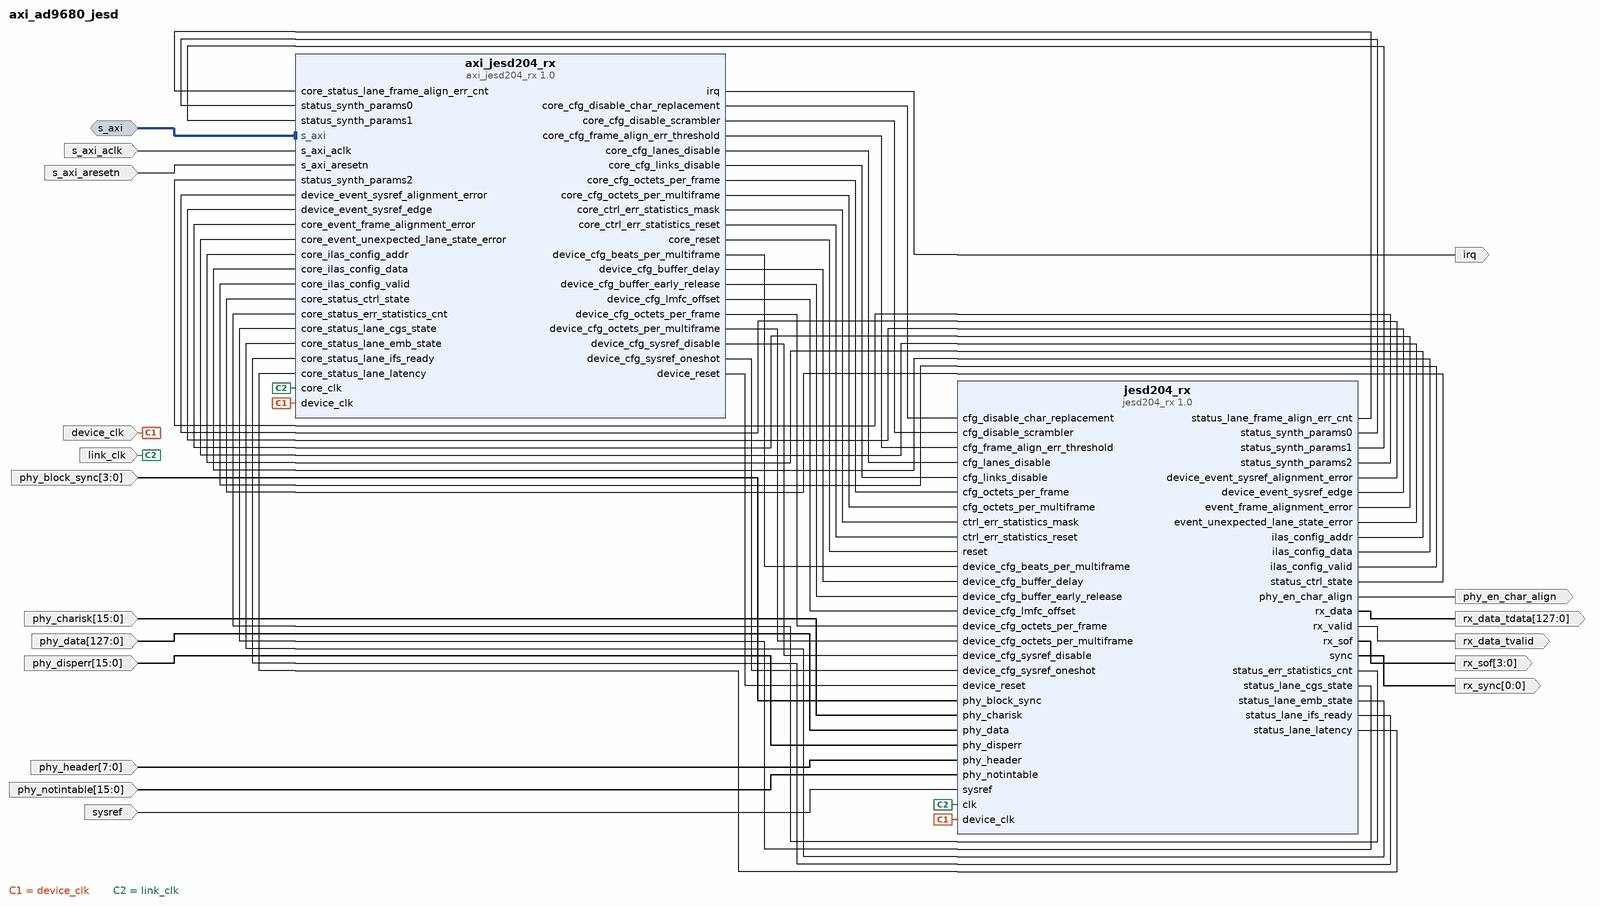
[diagram p0: block diagram of the top level]
# Vivado block design axi_ad9680_jesd, xczu7ev-fbvb900-1-e, Vivado 2022.2
create_bd_design axi_ad9680_jesd

create_bd_intf_port -mode Slave -vlnv xilinx.com:interface:aximm_rtl:1.0 s_axi
set_property -dict [list \
  CONFIG.ADDR_WIDTH 14 \
  CONFIG.ARUSER_WIDTH 0 \
  CONFIG.AWUSER_WIDTH 0 \
  CONFIG.BUSER_WIDTH 0 \
  CONFIG.DATA_WIDTH 32 \
  CONFIG.HAS_BRESP 1 \
  CONFIG.HAS_BURST 0 \
  CONFIG.HAS_CACHE 0 \
  CONFIG.HAS_LOCK 0 \
  CONFIG.HAS_PROT 1 \
  CONFIG.HAS_QOS 0 \
  CONFIG.HAS_REGION 0 \
  CONFIG.HAS_RRESP 1 \
  CONFIG.HAS_WSTRB 1 \
  CONFIG.ID_WIDTH 0 \
  CONFIG.MAX_BURST_LENGTH 1 \
  CONFIG.NUM_READ_OUTSTANDING 1 \
  CONFIG.NUM_READ_THREADS 1 \
  CONFIG.NUM_WRITE_OUTSTANDING 1 \
  CONFIG.NUM_WRITE_THREADS 1 \
  CONFIG.PROTOCOL AXI4LITE \
  CONFIG.READ_WRITE_MODE READ_WRITE \
  CONFIG.RUSER_BITS_PER_BYTE 0 \
  CONFIG.RUSER_WIDTH 0 \
  CONFIG.SUPPORTS_NARROW_BURST 0 \
  CONFIG.WUSER_BITS_PER_BYTE 0 \
  CONFIG.WUSER_WIDTH 0 \
] [get_bd_intf_ports s_axi]
create_bd_port -dir I -type clk device_clk
set_property -dict {CONFIG.FREQ_HZ 100000000} [get_bd_ports device_clk]
create_bd_port -dir I -type clk link_clk
set_property -dict {CONFIG.FREQ_HZ 100000000} [get_bd_ports link_clk]
create_bd_port -dir I -type clk s_axi_aclk
set_property -dict {CONFIG.FREQ_HZ 100000000} [get_bd_ports s_axi_aclk]
create_bd_port -dir I -type rst s_axi_aresetn
create_bd_port -dir O -type intr irq
create_bd_port -dir O -from 0 -to 0 rx_sync
create_bd_port -dir O phy_en_char_align
create_bd_port -dir I sysref
create_bd_port -dir O -from 127 -to 0 rx_data_tdata
create_bd_port -dir O rx_data_tvalid
create_bd_port -dir O -from 3 -to 0 rx_sof
create_bd_port -dir I -from 127 -to 0 phy_data
create_bd_port -dir I -from 7 -to 0 phy_header
create_bd_port -dir I -from 15 -to 0 phy_charisk
create_bd_port -dir I -from 15 -to 0 phy_notintable
create_bd_port -dir I -from 15 -to 0 phy_disperr
create_bd_port -dir I -from 3 -to 0 phy_block_sync

create_bd_cell -type ip -vlnv analog.devices:user:axi_jesd204_rx:1.0 axi_jesd204_rx
set_property -dict {CONFIG.NUM_LANES 4} [get_bd_cells axi_jesd204_rx]
create_bd_cell -type ip -vlnv analog.devices:user:jesd204_rx:1.0 jesd204_rx
set_property -dict {CONFIG.ASYNC_CLK 0 CONFIG.NUM_LANES 4} [get_bd_cells jesd204_rx]

# ---- connections ----

connect_bd_intf_net [get_bd_intf_ports s_axi] [get_bd_intf_pins axi_jesd204_rx/s_axi]
connect_bd_net [get_bd_ports device_clk] [get_bd_pins jesd204_rx/device_clk] [get_bd_pins axi_jesd204_rx/device_clk]
connect_bd_net [get_bd_pins axi_jesd204_rx/core_cfg_disable_char_replacement] [get_bd_pins jesd204_rx/cfg_disable_char_replacement]
connect_bd_net [get_bd_pins axi_jesd204_rx/core_cfg_disable_scrambler] [get_bd_pins jesd204_rx/cfg_disable_scrambler]
connect_bd_net [get_bd_pins axi_jesd204_rx/core_cfg_frame_align_err_threshold] [get_bd_pins jesd204_rx/cfg_frame_align_err_threshold]
connect_bd_net [get_bd_pins axi_jesd204_rx/core_cfg_lanes_disable] [get_bd_pins jesd204_rx/cfg_lanes_disable]
connect_bd_net [get_bd_pins axi_jesd204_rx/core_cfg_links_disable] [get_bd_pins jesd204_rx/cfg_links_disable]
connect_bd_net [get_bd_pins axi_jesd204_rx/core_cfg_octets_per_frame] [get_bd_pins jesd204_rx/cfg_octets_per_frame]
connect_bd_net [get_bd_pins axi_jesd204_rx/core_cfg_octets_per_multiframe] [get_bd_pins jesd204_rx/cfg_octets_per_multiframe]
connect_bd_net [get_bd_pins axi_jesd204_rx/core_ctrl_err_statistics_mask] [get_bd_pins jesd204_rx/ctrl_err_statistics_mask]
connect_bd_net [get_bd_pins axi_jesd204_rx/core_ctrl_err_statistics_reset] [get_bd_pins jesd204_rx/ctrl_err_statistics_reset]
connect_bd_net [get_bd_pins axi_jesd204_rx/core_reset] [get_bd_pins jesd204_rx/reset]
connect_bd_net [get_bd_pins axi_jesd204_rx/device_cfg_beats_per_multiframe] [get_bd_pins jesd204_rx/device_cfg_beats_per_multiframe]
connect_bd_net [get_bd_pins axi_jesd204_rx/device_cfg_buffer_delay] [get_bd_pins jesd204_rx/device_cfg_buffer_delay]
connect_bd_net [get_bd_pins axi_jesd204_rx/device_cfg_buffer_early_release] [get_bd_pins jesd204_rx/device_cfg_buffer_early_release]
connect_bd_net [get_bd_pins axi_jesd204_rx/device_cfg_lmfc_offset] [get_bd_pins jesd204_rx/device_cfg_lmfc_offset]
connect_bd_net [get_bd_pins axi_jesd204_rx/device_cfg_octets_per_frame] [get_bd_pins jesd204_rx/device_cfg_octets_per_frame]
connect_bd_net [get_bd_pins axi_jesd204_rx/device_cfg_octets_per_multiframe] [get_bd_pins jesd204_rx/device_cfg_octets_per_multiframe]
connect_bd_net [get_bd_pins axi_jesd204_rx/device_cfg_sysref_disable] [get_bd_pins jesd204_rx/device_cfg_sysref_disable]
connect_bd_net [get_bd_pins axi_jesd204_rx/device_cfg_sysref_oneshot] [get_bd_pins jesd204_rx/device_cfg_sysref_oneshot]
connect_bd_net [get_bd_pins axi_jesd204_rx/device_reset] [get_bd_pins jesd204_rx/device_reset]
connect_bd_net [get_bd_pins axi_jesd204_rx/irq] [get_bd_ports irq]
connect_bd_net -net jesd204_rx_0_status_lane_frame_align_err_cnt [get_bd_pins jesd204_rx/status_lane_frame_align_err_cnt] \
  [get_bd_pins axi_jesd204_rx/core_status_lane_frame_align_err_cnt]
connect_bd_net -net jesd204_rx_0_status_synth_params0 [get_bd_pins jesd204_rx/status_synth_params0] [get_bd_pins axi_jesd204_rx/status_synth_params0]
connect_bd_net -net jesd204_rx_0_status_synth_params1 [get_bd_pins jesd204_rx/status_synth_params1] [get_bd_pins axi_jesd204_rx/status_synth_params1]
connect_bd_net -net jesd204_rx_0_status_synth_params2 [get_bd_pins jesd204_rx/status_synth_params2] [get_bd_pins axi_jesd204_rx/status_synth_params2]
connect_bd_net [get_bd_pins jesd204_rx/device_event_sysref_alignment_error] [get_bd_pins axi_jesd204_rx/device_event_sysref_alignment_error]
connect_bd_net [get_bd_pins jesd204_rx/device_event_sysref_edge] [get_bd_pins axi_jesd204_rx/device_event_sysref_edge]
connect_bd_net [get_bd_pins jesd204_rx/event_frame_alignment_error] [get_bd_pins axi_jesd204_rx/core_event_frame_alignment_error]
connect_bd_net [get_bd_pins jesd204_rx/event_unexpected_lane_state_error] [get_bd_pins axi_jesd204_rx/core_event_unexpected_lane_state_error]
connect_bd_net [get_bd_pins jesd204_rx/ilas_config_addr] [get_bd_pins axi_jesd204_rx/core_ilas_config_addr]
connect_bd_net [get_bd_pins jesd204_rx/ilas_config_data] [get_bd_pins axi_jesd204_rx/core_ilas_config_data]
connect_bd_net [get_bd_pins jesd204_rx/ilas_config_valid] [get_bd_pins axi_jesd204_rx/core_ilas_config_valid]
connect_bd_net [get_bd_pins jesd204_rx/phy_en_char_align] [get_bd_ports phy_en_char_align]
connect_bd_net [get_bd_pins jesd204_rx/rx_data] [get_bd_ports rx_data_tdata]
connect_bd_net [get_bd_pins jesd204_rx/rx_sof] [get_bd_ports rx_sof]
connect_bd_net [get_bd_pins jesd204_rx/rx_valid] [get_bd_ports rx_data_tvalid]
connect_bd_net [get_bd_pins jesd204_rx/status_ctrl_state] [get_bd_pins axi_jesd204_rx/core_status_ctrl_state]
connect_bd_net [get_bd_pins jesd204_rx/status_err_statistics_cnt] [get_bd_pins axi_jesd204_rx/core_status_err_statistics_cnt]
connect_bd_net [get_bd_pins jesd204_rx/status_lane_cgs_state] [get_bd_pins axi_jesd204_rx/core_status_lane_cgs_state]
connect_bd_net [get_bd_pins jesd204_rx/status_lane_emb_state] [get_bd_pins axi_jesd204_rx/core_status_lane_emb_state]
connect_bd_net [get_bd_pins jesd204_rx/status_lane_ifs_ready] [get_bd_pins axi_jesd204_rx/core_status_lane_ifs_ready]
connect_bd_net [get_bd_pins jesd204_rx/status_lane_latency] [get_bd_pins axi_jesd204_rx/core_status_lane_latency]
connect_bd_net [get_bd_pins jesd204_rx/sync] [get_bd_ports rx_sync]
connect_bd_net [get_bd_ports link_clk] [get_bd_pins jesd204_rx/clk] [get_bd_pins axi_jesd204_rx/core_clk]
connect_bd_net [get_bd_ports phy_block_sync] [get_bd_pins jesd204_rx/phy_block_sync]
connect_bd_net [get_bd_ports phy_charisk] [get_bd_pins jesd204_rx/phy_charisk]
connect_bd_net [get_bd_ports phy_data] [get_bd_pins jesd204_rx/phy_data]
connect_bd_net [get_bd_ports phy_disperr] [get_bd_pins jesd204_rx/phy_disperr]
connect_bd_net [get_bd_ports phy_header] [get_bd_pins jesd204_rx/phy_header]
connect_bd_net [get_bd_ports phy_notintable] [get_bd_pins jesd204_rx/phy_notintable]
connect_bd_net [get_bd_ports s_axi_aclk] [get_bd_pins axi_jesd204_rx/s_axi_aclk]
connect_bd_net [get_bd_ports s_axi_aresetn] [get_bd_pins axi_jesd204_rx/s_axi_aresetn]
connect_bd_net [get_bd_ports sysref] [get_bd_pins jesd204_rx/sysref]

# ---- address map ----
assign_bd_address -offset 0x0000 -range 16K -target_address_space [get_bd_addr_spaces s_axi] [get_bd_addr_segs axi_jesd204_rx/s_axi/reg0]

validate_bd_design
save_bd_design
